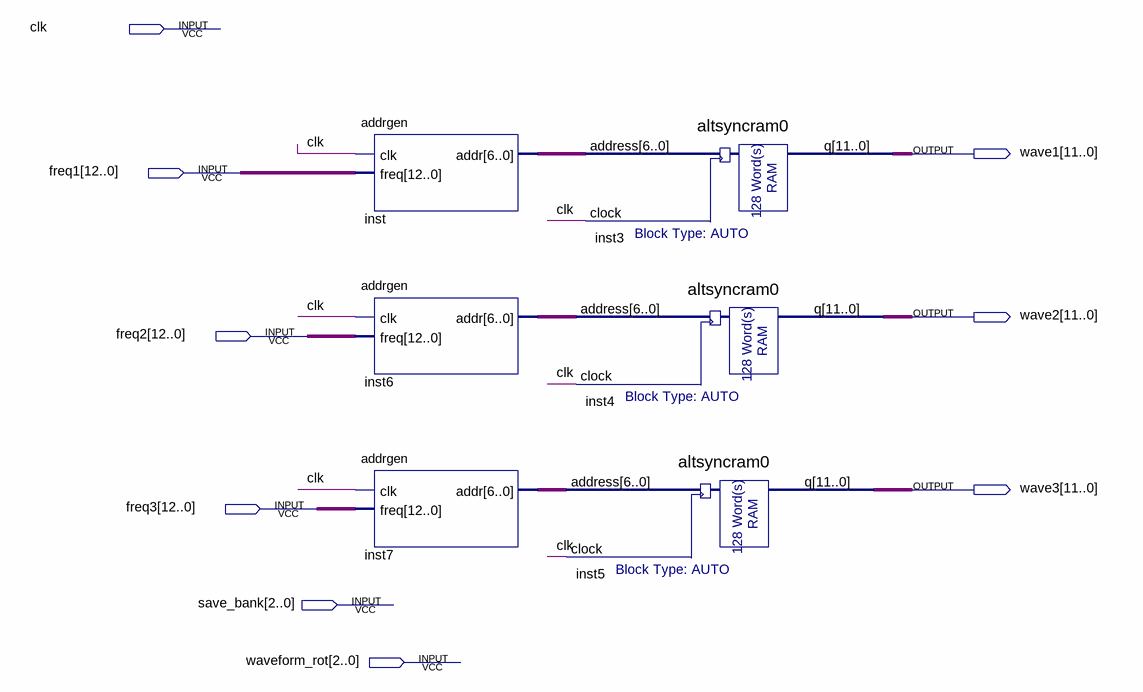
[diagram p0: schematic sheet]
// Quartus schematic wavegenerator.bdf as structural Verilog: 6 symbols, 9 pins
module wavegenerator (
  input  clk,
  input  [12:0] freq1,
  input  [12:0] freq2,
  input  [12:0] freq3,
  input  [2:0] save_bank,
  input  [2:0] waveform_rot,
  output [11:0] wave1,
  output [11:0] wave2,
  output [11:0] wave3
);

  wire [6:0] inst6_addr, inst7_addr, inst_addr;

  addrgen inst (.clk(clk), .freq(freq1), .addr(inst_addr));
  addrgen inst6 (.clk(clk), .freq(freq2), .addr(inst6_addr));
  addrgen inst7 (.clk(clk), .freq(freq3), .addr(inst7_addr));
  altsyncram0 inst3 (.address(inst_addr), .clock(clk), .q(wave1));
  altsyncram0 inst4 (.address(inst6_addr), .clock(clk), .q(wave2));
  altsyncram0 inst5 (.address(inst7_addr), .clock(clk), .q(wave3));
endmodule
